# Altium schematic sheet GarageOpener_1X.SchDoc
size A
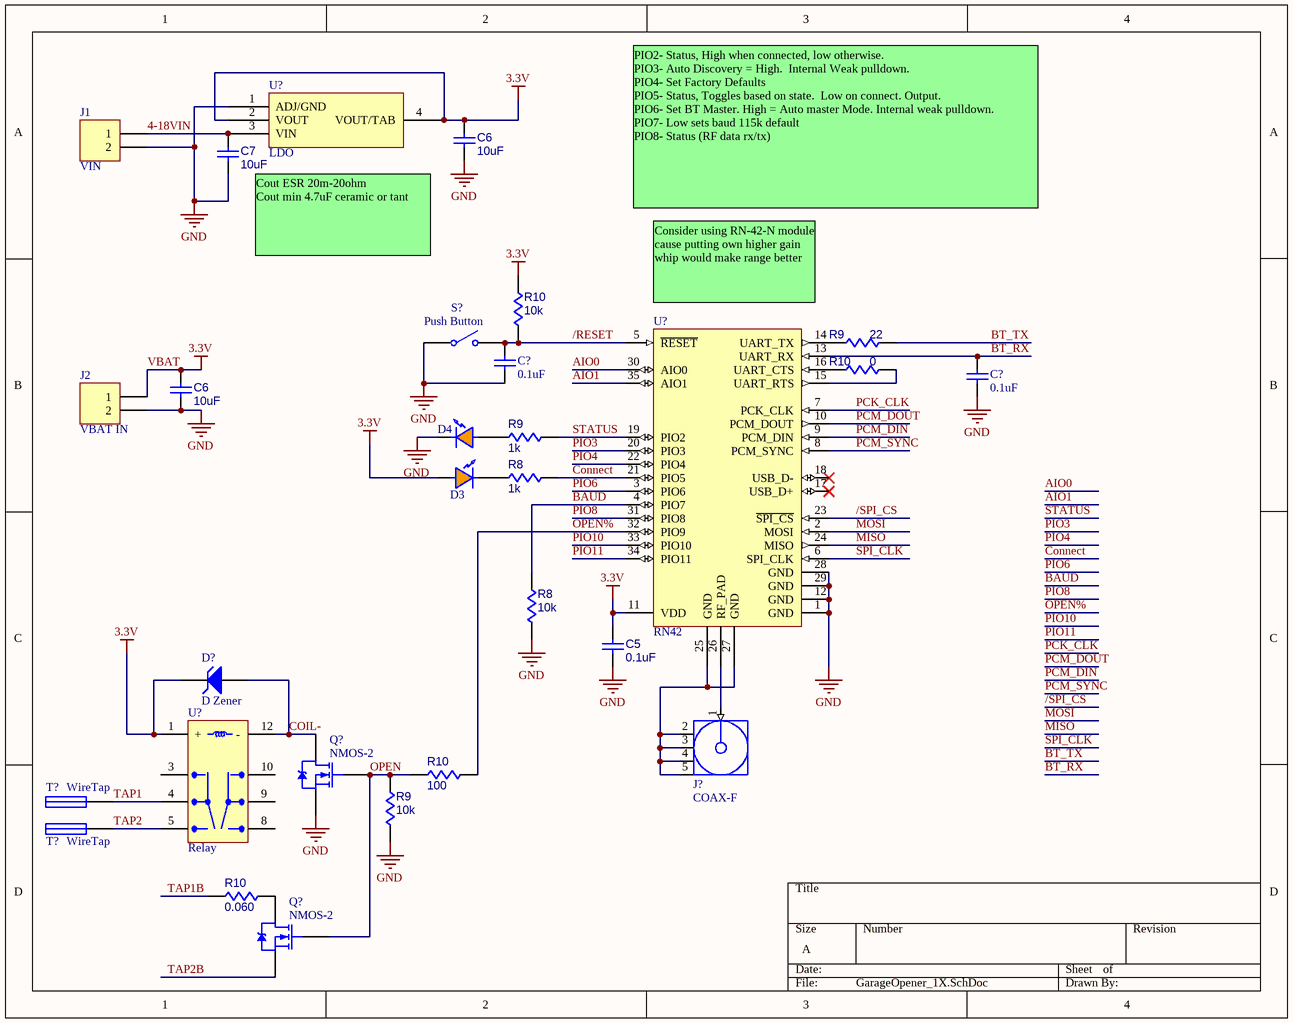
[diagram p0: GarageOpener_1X.SchDoc]

## Parts
(Parts that share a designator on the sheet are numbered #1, #2 ... from top to bottom, then left to right.)
C5  0.1uF  [CC0603]
C6#1  10uF  [CC0603]
C6#2  10uF  [CC0603]
C7  10uF  [CC0603]
C?#1  0.1uF  [RAD-0.3]
C?#2  0.1uF  [RAD-0.3]
D3  (no value)  [KINGBRIGHT_APA1606SECK]
D4  (no value)  [KINGBRIGHT_APA1606SECK]
D?  D Zener  [DIODE-0.7]
J1  VIN  [HDR1X2]
J2  VBAT IN  [HDR1X2]
J?  COAX-F  [MCX5.08-H5]
Q?#1  NMOS-2  [TO-220AB]
Q?#2  NMOS-2  [TO-220AB]
R8#1  1k  [R0603]
R8#2  10k  [R0603]
R9#1  22  [R0603]
R9#2  1k  [R0603]
R9#3  10k  [R0603]
R10#1  10k  [R0603]
R10#2  0  [R0603]
R10#3  100  [R0603]
R10#4  0.060  [R0603]
S?  Push Button
T?#1  WireTap  [PIN-W2/E2.8]
T?#2  WireTap  [PIN-W2/E2.8]
U?#1  LDO
U?#2  RN42  [RN-42]
U?#3  Relay

## Nets
GND: C5.2 C6#1.2 C6#2.2 C7.2 C?#1.1 C?#2.1 D4.C J1.2 J2.2 Q?#1.3(S) R8#2.2 R9#3.2 S?.1(COMMON) U?#1.1(ADJ/GND) U?#2.1(GND) U?#2.12(GND) U?#2.28(GND) U?#2.29(GND)
VBAT: C5.1 C6#1.1 C6#2.1 D3.A D?.2(K) J2.1 R10#1.1 U?#1.2(VOUT) U?#1.4(VOUT/TAB) U?#2.11(VDD) U?#3.1(+)  [also labelled 3.3V]
4-18VIN: C7.1 J1.1 U?#1.3(VIN)
/RESET: C?#1.2 R10#1.2 S?.2(NO) U?#2.5(~{RESET})
/SPI_CS: U?#2.23(~{SPI_CS})
AIO0: U?#2.30(AIO0)
AIO1: U?#2.35(AIO1)
BAUD: R8#2.1 U?#2.4(PIO7)
BT_RX: C?#2.2 U?#2.13(UART_RX)
BT_TX: R9#1.1
COIL-: D?.1(A) Q?#1.2(D) U?#3.12(-)
Connect: R8#1.1 U?#2.21(PIO5)
MISO: U?#2.24(MISO)
MOSI: U?#2.2(MOSI)
OPEN: Q?#1.1(G) Q?#2.1(G) R9#3.1 R10#3.1
OPEN%: R10#3.2 U?#2.32(PIO9)
PCK_CLK: U?#2.7(PCK_CLK)
PCM_DIN: U?#2.9(PCM_DIN)
PCM_DOUT: U?#2.10(PCM_DOUT)
PCM_SYNC: U?#2.8(PCM_SYNC)
PIO3: U?#2.20(PIO3)
PIO4: U?#2.22(PIO4)
PIO6: U?#2.3(PIO6)
PIO8: U?#2.31(PIO8)
PIO10: U?#2.33(PIO10)
PIO11: U?#2.34(PIO11)
SPI_CLK: U?#2.6(SPI_CLK)
STATUS: R9#2.1 U?#2.19(PIO2)
TAP1: T?#1.1 U?#3.4
TAP1B: R10#4.1
TAP2: T?#2.1 U?#3.5
TAP2B: Q?#2.3(S)
NetD3_C: D3.C R8#1.2
NetD4_A: D4.A R9#2.2
NetJ?_1: J?.1(Signal) U?#2.26(RF_PAD)
NetJ?_2: J?.2(GND) J?.3(GND) J?.4(GND) J?.5(GND) U?#2.25(GND) U?#2.27(GND)
NetQ?#2_2: Q?#2.2(D) R10#4.2
NetR9#1_2: R9#1.2 U?#2.14(UART_TX)
NetR10#2_1: R10#2.1 U?#2.15(UART_RTS)
NetR10#2_2: R10#2.2 U?#2.16(UART_CTS)

Not connected (* = marked no-connect by the designer): T?#1 2; T?#2 2; U?#2 17(USB_D+)* 18(USB_D-)*; U?#3 3 8 9 10

## Notes on the sheet
- PIO2- Status, High when connected, low otherwise.
  PIO3- Auto Discovery = High.  Internal Weak pulldown.
  PIO4- Set Factory Defaults
  PIO5- Status, Toggles based on state.  Low on connect. Output.
  PIO6- Set BT Master. High = Auto master Mode. Internal weak pulldown.
  PIO7- Low sets baud 115k default
  PIO8- Status (RF data rx/tx)
- Cout ESR 20m-20ohm
  Cout min 4.7uF ceramic or tant
- Consider using RN-42-N module cause putting own higher gain whip would make range better

## Library data of the parts
C5 C6#1 C6#2 C7 = 0.1uF,50V,CC0603,X7R,+/-20%: 0.1uF 50V, in a CC0603, X7R ,+/-20%,LF; Component Kind: Standard
C?#1 C?#2 = Cap: Capacitor
D3 D4 = KINGBRIGHT_APA1606SECK: LED 1.6X0.6MM 601NM Orange Right-Angle SMD
D? = D Zener: Zener Diode; Published: 8-Jun-2000; LatestRevisionDate: 17-Jul-2002; LatestRevisionNote: Re-released for DXP Platform.; PackageReference: DIODE-0.7; Publisher: Altium Limited; PackageDescription: Diode, Thru-Hole; 2 Leads; 0.7 in Pin Spacing
J1 J2 = Header 2: Header, 2-Pin; LatestRevisionDate: 17-Jul-2002; LatestRevisionNote: Re-released for DXP Platform.; Publisher: Altium Limited
J? = COAX-F: SMA Right Angle Conn; PartNo: SMA-JR-P2; Note: Buy at Avnet; HelpURL: http://www.futureelectronics.com/en/technologies/interconnect/connectors-rf/sma-ssma-connectors/Pages/3021881-2081235-1.aspx?IM=0
Q?#1 Q?#2 = NMOS-2: N-Channel Power MOSFET; Note: Pin 2 is electrically connected to pin 4.; Published: 8-Jun-2000; LatestRevisionDate: 17-Jul-2002; LatestRevisionNote: Re-released for DXP Platform.; DatasheetVersion: PD-9.814; PackageVersion: Feb-1997; PackageReference: TO-220AB; Publisher: Altium Limited; PackageDescription: TO, Thru-Hole, Vertical, Heatsink Mounted; 3 In-Line Leads; Pitch 2.54 mm; ComponentLink1Description: Manufacturer Link; ComponentLink1URL: http://www.irf.com/
R8#1 R8#2 R9#1-R9#3 R10#1-R10#4 = 1.00K,R0603,1%: 1.00K, Gen Purp Chip, R0603 0.1W 1%; Component Kind: Standard
S? = SW-SPST: Tacticle Pushbutton; PartNo: PTS525SM10SMTR LFS; HelpURL: http://www.digikey.com/product-detail/en/PTS525SM10SMTR%20LFS/CKN9104CT-ND/1146923
T?#1 T?#2 = Fuse 1: Fuse
U?#1 = LDO: IC REG LDO 3.3V 1A SOT-223-4; PartNo: NCP1117LPST33T3G
U?#2 = RN-42: Roving Networks Bluetooth Serial Module; PartNo: RN-42N; HelpURL: http://www.digikey.com/product-detail/en/RN42N-I%2FRM/740-1043-2-ND/2636647?WT.z_cid=ref_octopart_dkc_buynow&cur=USD
U?#3 = Relay: 3VDC, 64.3 Ohm coil. 140mW. Contacts rated 1A @ 30Vdc; PartNo: NA3W-K; Note: Buy at All Electronics; HelpURL: http://components.arrow.com/part/detail/4174000S5207706N1175?region=na